# EAGLE design ArduinoSmarticleNoAccelNoSolar (EAGLE 8.3.2)
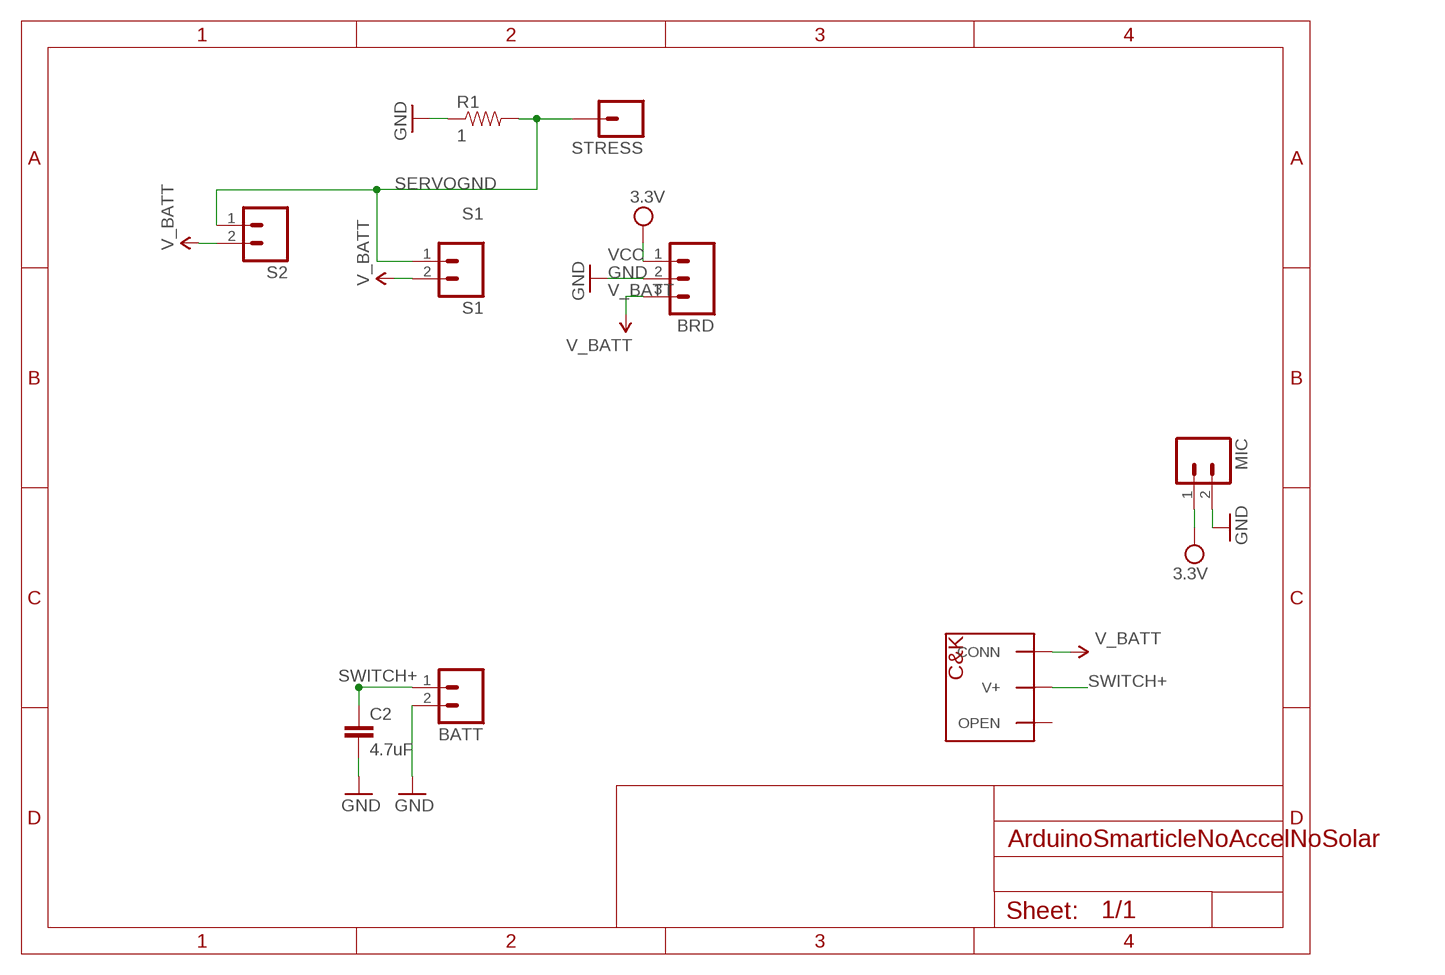
[diagram p0: schematic, sheet 1]

## Parts
BATT  M02PTH  [1X02]
BRD  M03PTH  [1X03]
C2  4.7uF  4.7UF-6.3V-10%(0603)0603  [0603-CAP]
MIC  M02PTH  [1X02]
R1  1  2.0KOHM1/10W5%(0603)  [0603-RES]
S1  S1  M02PTH  [1X02]
S2  M02PTH  [1X02]
STRESS  M01PTH  [1X01]
U$1  WILL-BLACKSLIDESWITCH  [WILL-BLACKSLIDESWITCH]

## Nets
GND: BATT.2 BRD.2 C2.2 MIC.2 R1.1
SERVOGND: R1.2 S1.1 S2.1 STRESS.1
SWITCH+: BATT.1 C2.1 U$1.V+
V_BATT: BRD.3 S1.2 S2.2 U$1.CONN
VCC: BRD.1 MIC.1 ; supply symbol labelled 3.3V
Unconnected: U$1.NC(OPEN)

## Library data of the parts
BATT MIC S1 S2 = SparkFun-Connectors:M02: Standard 2-pin 0.1" header. Use with - straight break away headers ( PRT-00116) - right angle break away headers (PRT-00553) - swiss pins (PRT-00743) - machine pins (PRT-00117) - female headers (PRT-00115) Molex polarized connector foot print use with: PRT-08233 with associated crimp pins and housings. 2.54_SCREWTERM for use with PRT-10571. 3.5mm Screw Terminal footprints for PRT-08084 5mm Screw Terminal footprints for use with PRT-08432
BRD = SparkFun-Connectors:M03: Header 3 Standard 3-pin 0.1" header. Use with straight break away headers (SKU : PRT-00116), right angle break away headers (PRT-00553), swiss pins (PRT-00743), machine pins (PRT-00117), and female headers (PRT-00115). Molex polarized connector foot print use with SKU : PRT-08232 with associated crimp pins and housings.
C2 = SparkFun-Capacitors:4.7UF-6.3V-10%(0603): CAP-08280; PROD_ID: CAP-08280
R1 = SparkFun-Resistors:2.0KOHM1/10W5%(0603): RES-08296; PROD_ID: RES-08296; VALUE: 2.0k
STRESS = SparkFun-Connectors:M01: Header 1 Standard 1-pin 0.1" header. Use with straight break away headers (SKU : PRT-00116), right angle break away headers (PRT-00553), swiss pins (PRT-00743), machine pins (PRT-00117), and female headers (PRT-00115). SMTSO-256-ET is a "flush mount" nut for a 4-40 screw. The older package used to be too tight, and did not allow it to sit properly thru the drill hit. The latest (0.165DIA) fits nice and snug.
U$1 = Will-Switch:WILL-BLACKSLIDESWITCH

## Board
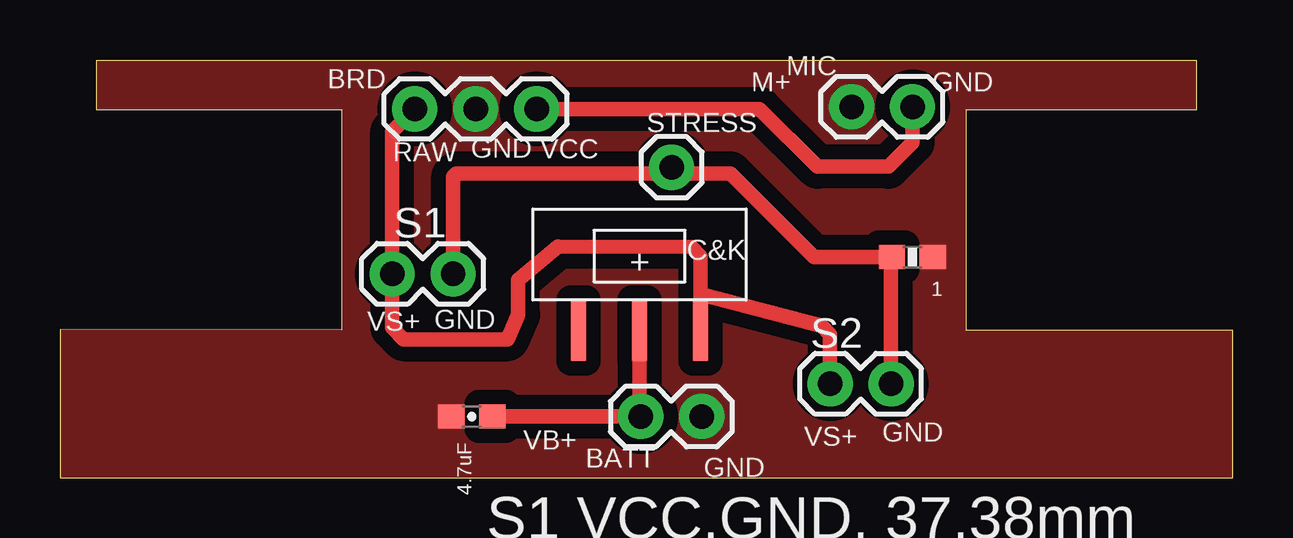
[diagram p1: board, top side]

Size 48.9 x 17.44 mm. Coordinates in mm from the lower left corner, seen from the top.
Outline: 0,6.19 0,0 48.89,0 48.89,6.19 37.75,6.19 37.75,15.34 47.37,15.34 47.37,17.44 1.52,17.44 1.52,15.34 11.75,15.34 11.75,6.19 0,6.19
Copper layers (1*16): Top 0.035mm / dielectric 1.5mm / Bottom 0.035mm
Design rules "SparkFun *": minimum track width 8mil, minimum drill 20mil, track to track 15mil, track to pad 15mil, pad to pad 8mil, via to via 8mil, smd to smd 8mil, copper to edge 0mil, drill to drill 16mil, minimum pad ring 12mil, minimum via ring 10mil, stop-mask expansion 4mil, vias tented up to drill 20mil, thermal gap 10mil

### Footprints (pad centres in the part's own frame; a part is rotated, then mirrored left to right if it is on the bottom)
1X02 = drill 1.016 pad 1.88: 1 0,0; 2 2.54,0
1X03 = drill 1.016 pad 1.88: 1 0,0; 2 2.54,0; 3 5.08,0
0603-CAP = smd 1.1 x 1: 1 -0.85,0; 2 0.85,0
0603-RES = smd 1.1 x 1: 1 -0.85,0; 2 0.85,0
1X01 = drill 1.016 pad 1.88: 1 0,0
WILL-BLACKSLIDESWITCH = smd 2.54 x 0.635: CONN 5.08,6.985; NC 5.08,1.905; V+ 5.08,4.445

### Placement (x,y rotation side)
BATT  24.21,2.57 0 top
BRD  19.87,15.4 180 top
C2  17.17,2.57 180 top
MIC  35.54,15.48 180 top
R1  35.53,9.22 180 top
S1  16.39,8.52 180 top
S2  34.64,3.93 180 top
STRESS  25.5,12.96 0 top
U$1  19.71,11.23 270 top

### Tracks (layer width: path | path; a pad name or v marks a point on that pad's centre or on a via)
GND
  pour Top (isolate 0.61, no thermals): 0,0 0,6.18 11.75,6.18 11.75,15.34 1.52,15.34 1.52,17.44 47.37,17.44 47.37,15.34 37.75,15.34 37.75,6.19 48.9,6.18 48.9,0 0.05,0
SERVOGND
  Top 0.61: STRESS.1 25.58,12.88 25.4,12.7 | S2.1 34.64,9.19 R1.2 31.42,9.22 27.94,12.7 25.4,12.7 | S1.1 16.39,12.57 16.51,12.7 25.4,12.7
SWITCH+
  Top 0.61: U$1.V+ 24.16,2.62 BATT.1 C2.1
V_BATT
  Top 0.61: 26.7,7.42 26.7,9.25 26.32,9.63 20.75,9.65 19.1,8.26 19.1,6.81 18.65,5.79 14.33,5.79 13.85,6.27 S1.2 13.85,14.46 BRD.3 | 26.7,7.42 U$1.CONN | S2.2 32.1,6 31.75,6.35 26.9,7.62 26.7,7.42
VCC
  Top 0.61: MIC.1 35.54,14 34.52,12.98 31.57,12.98 29.16,15.39 BRD.1

### Text on the board
tPlace: RAW, GND, VCC 26mm | Battery 45mm | Stress 28 A7 | Mic 16mm A6 | Mic GND,VCC 26mm, 26 mm | M+ | GND | RAW | GND | VCC | + | VS+ | GND | VB+ | GND | GND | VS+ | S1 VCC,GND, 37,38mm | S2 VCC,GND, 37,38mm | S1 SIG, 48 mm D5 | S2 SIG, 52mm D6